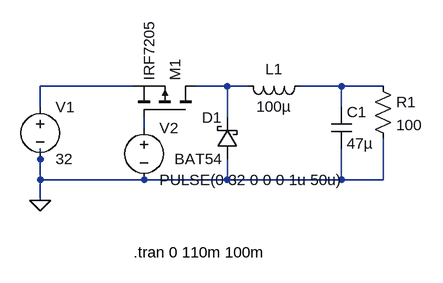
[diagram p0: schematic buck.asc]
buck.asc, the LTspice schematic file:
Version 4
SHEET 1 880 680
WIRE -224 64 -368 64
WIRE -80 64 -128 64
WIRE -48 64 -80 64
WIRE 96 64 32 64
WIRE 160 64 96 64
WIRE -368 96 -368 64
WIRE 96 96 96 64
WIRE -80 112 -80 64
WIRE -208 128 -208 112
WIRE -368 176 -368 160
WIRE -368 208 -368 176
WIRE -208 208 -368 208
WIRE -80 208 -80 176
WIRE -80 208 -208 208
WIRE 96 208 96 160
WIRE 96 208 -80 208
WIRE 160 208 160 144
WIRE 160 208 96 208
WIRE -368 240 -368 208
FLAG -368 240 0
SYMBOL pmos -128 112 M270
SYMATTR InstName M1
SYMATTR Value IRF7205
SYMBOL voltage -368 80 R0
WINDOW 123 0 0 Left 2
WINDOW 39 0 0 Left 2
SYMATTR InstName V1
SYMATTR Value 32
SYMBOL ind 48 48 R90
WINDOW 0 5 56 VBottom 2
WINDOW 3 32 56 VTop 2
SYMATTR InstName L1
SYMATTR Value 100µ
SYMBOL res 144 48 R0
SYMATTR InstName R1
SYMATTR Value 100
SYMBOL schottky -64 176 R180
WINDOW 0 24 64 Left 2
WINDOW 3 24 0 Left 2
SYMATTR InstName D1
SYMATTR Value BAT54
SYMATTR Description Diode
SYMATTR Type diode
SYMBOL voltage -208 112 R0
WINDOW 123 0 0 Left 2
WINDOW 39 0 0 Left 2
SYMATTR InstName V2
SYMATTR Value PULSE(0 32 0 0 0 1u 50u)
SYMBOL cap 80 96 R0
SYMATTR InstName C1
SYMATTR Value 47µ
TEXT -224 320 Left 2 !.tran 0 110m 100m

The netlist it stands for:
* buck.asc
M1 N002 N004 N001 N001 IRF7205
V1 N001 0 32
L1 N003 N002 100µ
R1 N003 0 100
D1 0 N002 BAT54
V2 N004 0 PULSE(0 32 0 0 0 1u 50u)
C1 N003 0 47µ
.model D D
.lib standard.dio
.model NMOS NMOS
.model PMOS PMOS
.lib standard.mos
.tran 0 110m 100m
.backanno
.end